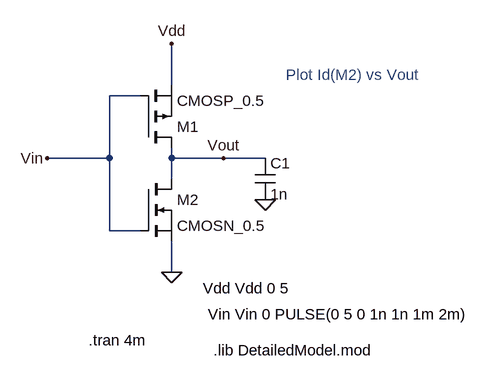
[diagram p0: schematic ee306_hw5_q5.asc]
ee306_hw5_q5.asc, the LTspice schematic file:
Version 4
SHEET 1 880 680
WIRE 256 -128 256 -192
WIRE 208 -112 160 -112
WIRE 160 -16 160 -112
WIRE 160 -16 64 -16
WIRE 256 -16 256 -32
WIRE 336 -16 256 -16
WIRE 400 -16 336 -16
WIRE 256 16 256 -16
WIRE 160 96 160 -16
WIRE 208 96 160 96
WIRE 256 160 256 112
FLAG 256 160 0
FLAG 256 -192 Vdd
FLAG 64 -16 Vin
FLAG 336 -16 Vout
FLAG 400 48 0
SYMBOL pmos 208 -32 M180
SYMATTR InstName M1
SYMATTR Value CMOSP_0.5
SYMBOL cap 384 -16 R0
SYMATTR InstName C1
SYMATTR Value 1n
SYMBOL nmos 208 16 R0
SYMATTR InstName M2
SYMATTR Value CMOSN_0.5
TEXT 304 184 Left 2 !Vdd Vdd 0 5
TEXT 128 264 Left 2 !.tran 4m
TEXT 312 224 Left 2 !Vin Vin 0 PULSE(0 5 0 1n 1n 1m 2m)
TEXT 320 280 Left 2 !.lib DetailedModel.mod
TEXT 432 -144 Left 2 ;Plot Id(M2) vs Vout

The netlist it stands for:
* ee306_hw5_q5.asc
M1 Vout Vin Vdd Vdd CMOSP_0.5
C1 Vout 0 1n
M2 Vout Vin 0 0 CMOSN_0.5
.model NMOS NMOS
.model PMOS PMOS
.lib standard.mos
Vdd Vdd 0 5
.tran 4m
Vin Vin 0 PULSE(0 5 0 1n 1n 1m 2m)
.lib DetailedModel.mod
* Plot Id(M2) vs Vout
.backanno
.end

* Results of the author's LTspice run, read from the files saved beside the schematic
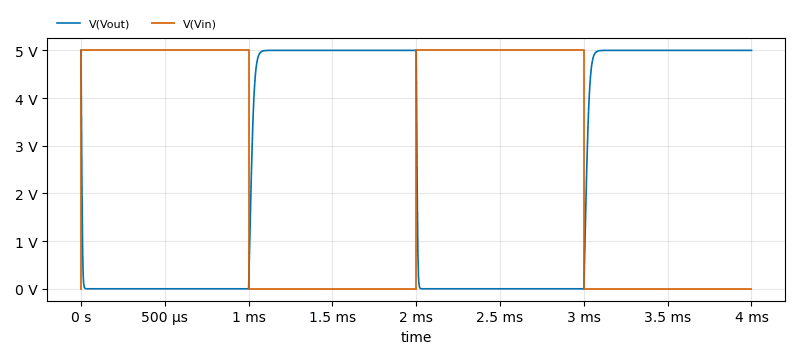
[diagram p1: Transient Analysis of ee306_hw5_q5.asc, plotted from the saved traces]
* Transient Analysis, 1 run:
*   V(Vout): min -154.5 µV, max 5 V, average 2.464 V, rms 3.491 V, last 5 V
*   V(Vin): min 0 V, max 5 V, average 2.5 V, rms 3.536 V, last 0 V